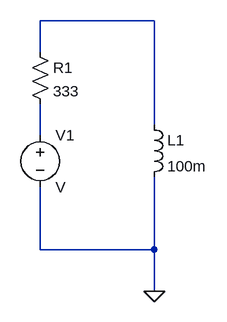
[diagram p0: schematic Draft1.asc]
Draft1.asc, the LTspice schematic file:
Version 4
SHEET 1 880 680
WIRE 256 16 80 16
WIRE 80 64 80 16
WIRE 256 176 256 16
WIRE 80 192 80 144
WIRE 80 368 80 272
WIRE 256 368 256 256
WIRE 256 368 80 368
WIRE 256 432 256 368
FLAG 256 432 0
SYMBOL res 64 48 R0
SYMATTR InstName R1
SYMATTR Value 333
SYMBOL ind 240 160 R0
SYMATTR InstName L1
SYMATTR Value 100m
SYMBOL voltage 80 176 R0
SYMATTR InstName V1

The netlist it stands for:
* Draft1.asc
R1 N001 N002 333
L1 N001 0 100m
V1 N002 0 V
.backanno
.end